# EAGLE design assgn2 (EAGLE 9.6.2)
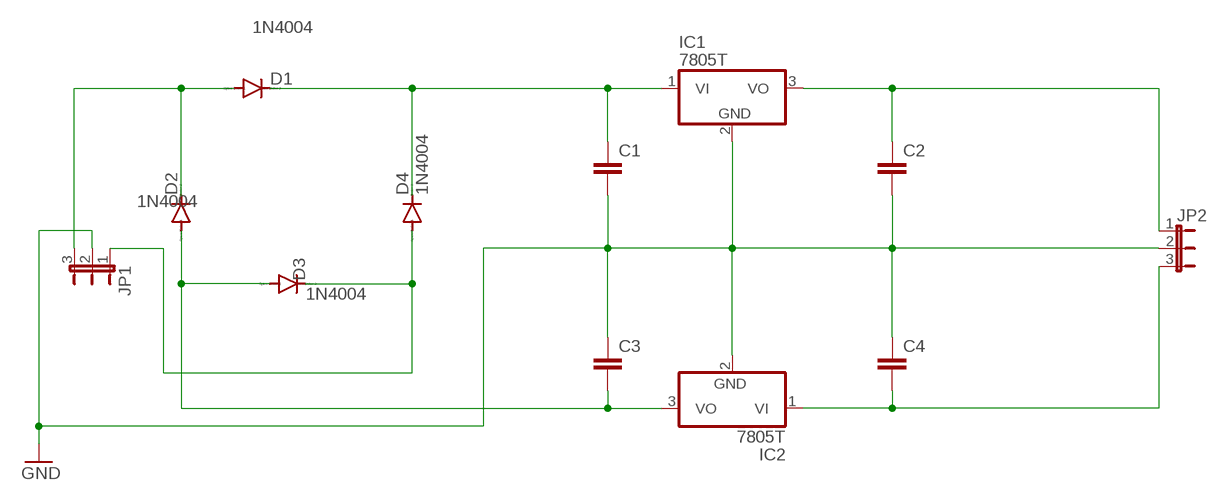
[diagram p0: schematic, sheet 1]

## Parts
C1  C2,5-3  [C2.5-3]
C2  C2,5-3  [C2.5-3]
C3  C2,5-3  [C2.5-3]
C4  C2,5-3  [C2.5-3]
D1  1N4004  [DO41-10]
D2  1N4004  [DO41-10]
D3  1N4004  [DO41-10]
D4  1N4004  [DO41-10]
IC1  7805T  [TO220H]
IC2  7805T  [TO220H]
JP1  JP2E  [JP2]
JP2  JP2E  [JP2]

## Nets
GND: C1.2 C2.2 C3.1 C4.1 IC1.2(GND) IC2.2(GND) JP1.2 JP2.2
N$1: D1.A D2.C JP1.3
N$2: C4.2 IC2.1(VI) JP2.3
N$3: C2.1 IC1.3(VO) JP2.1
N$6: C1.1 D1.C D4.C IC1.1(VI)
N$7: D3.C D4.A JP1.1
N$8: C3.2 D2.A D3.A IC2.3(VO)

## Library data of the parts
C1-C4 = capacitor-wima:C: CAPACITOR naming: grid - package width
D1-D4 = diode:1N4004: DIODE general purpose rectifier, 1 A
IC1 IC2 = linear:78*: Positive VOLTAGE REGULATOR Source: http://cache.national.com/ds/LM/LM78L05.pdf http://www.fairchildsemi.com/ds/LM/LM7805.pdf
JP1 JP2 = jumper:JP2E: JUMPER

## Board
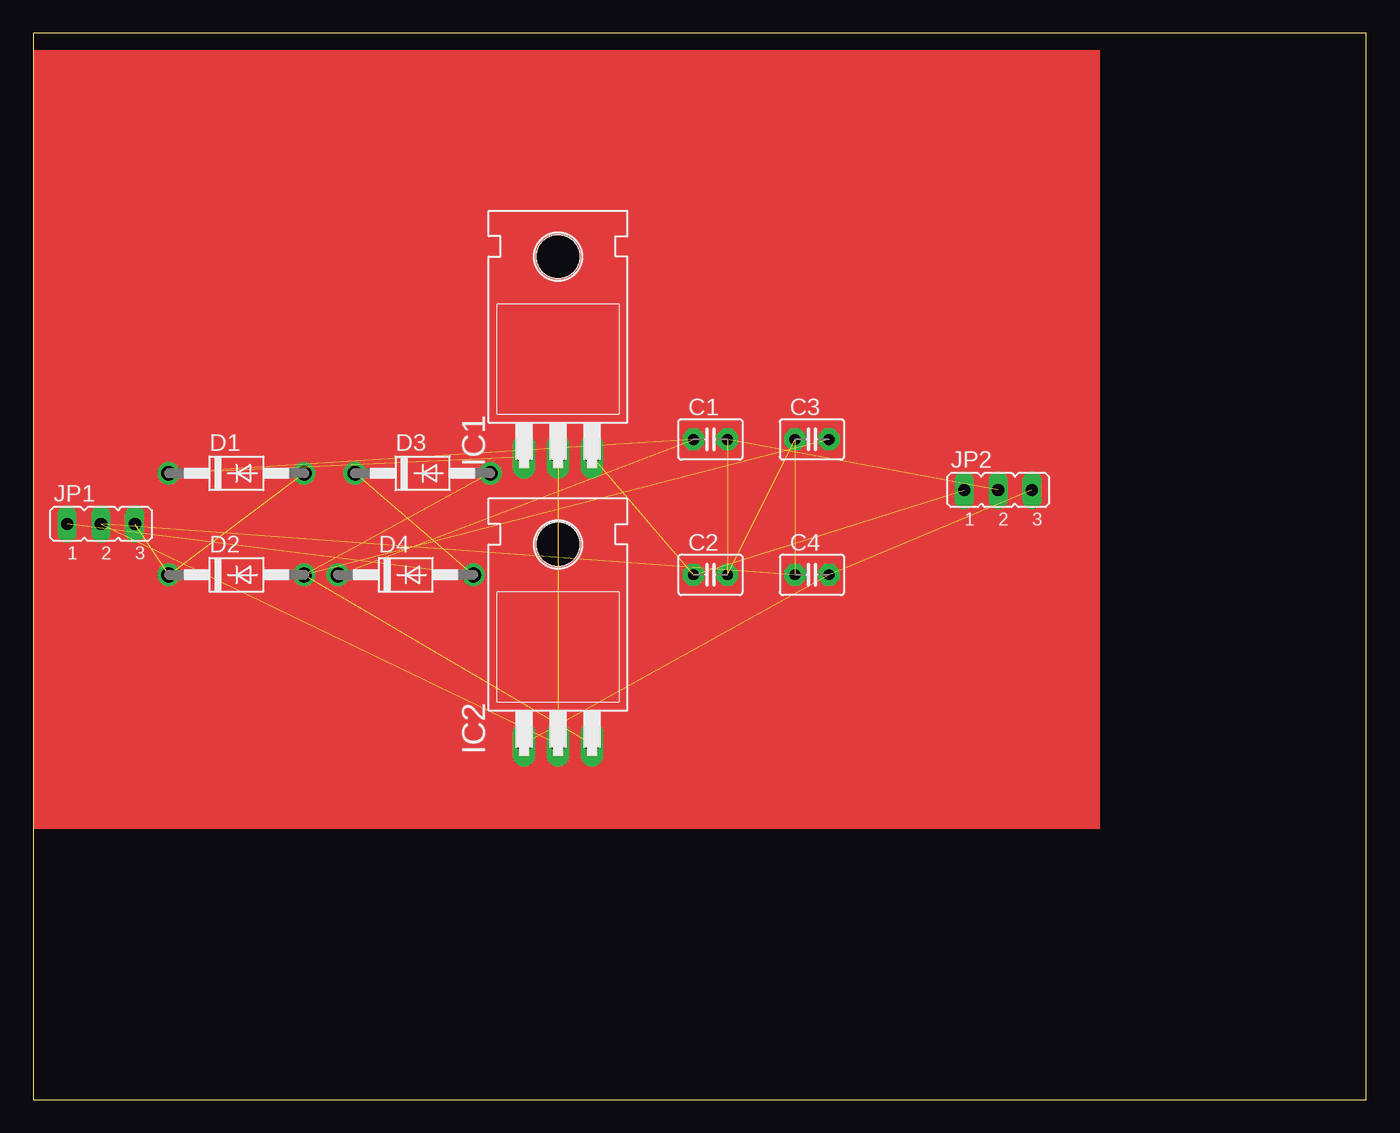
[diagram p1: board, top side]

Size 100 x 80 mm. Coordinates in mm from the lower left corner, seen from the top.
Outline: 0,0 100,0 100,80 0,80 0,0
Copper layers (1*16): Top 0.035mm / dielectric 1.5mm / Bottom 0.035mm
Design rules "default": minimum track width 6mil, minimum drill 0.35mm, track to track 6mil, track to pad 6mil, pad to pad 6mil, via to via 6mil, smd to smd 6mil, copper to edge 40mil, drill to drill 6mil, minimum pad ring 10mil, minimum via ring 8mil, stop-mask expansion 4mil, vias tented up to drill 0mil, thermal gap 10mil

### Footprints (pad centres in the part's own frame; a part is rotated, then mirrored left to right if it is on the bottom)
C2.5-3 = drill 0.813 pad 1.6 octagon: 1 -1.27,0; 2 1.27,0
DO41-10 = drill 1.118: A 5.08,0; C -5.08,0
TO220H = drill 1.118 long: 1 -2.54,-10.16; 2 0,-10.16; 3 2.54,-10.16 | hole 3.302: 0,4.826
JP2 = drill 0.914 long: 1 -2.54,0; 2 0,0; 3 2.54,0

### Placement (x,y rotation side)
C1  50.8,49.53 0 top
C2  50.8,39.37 0 top
C3  58.42,49.53 0 top
C4  58.42,39.37 0 top
D1  15.24,46.99 0 top
D2  15.24,39.37 0 top
D3  29.21,46.99 0 top
D4  27.94,39.37 0 top
IC1  39.37,58.42 0 top
IC2  39.37,36.83 0 top
JP1  5.08,43.18 0 top
JP2  72.39,45.72 0 top

### Tracks (layer width: path | path; a pad name or v marks a point on that pad's centre or on a via)
GND  (7 unrouted)
N$1  (2 unrouted)
N$2  (2 unrouted)
N$3  (2 unrouted)
N$4
  cutout Top: -7.62,82.55 -7.62,-6.35 104.14,-6.35 105.41,-5.08 105.41,85.09 104.14,86.36 -5.08,86.36 -7.62,83.82
N$6  (3 unrouted)
N$7  (2 unrouted)
N$8  (3 unrouted)
(copper drawn outside any net)
  shapes: Top area x1